# Altium project PCB_Button_PCB.PrjPcb
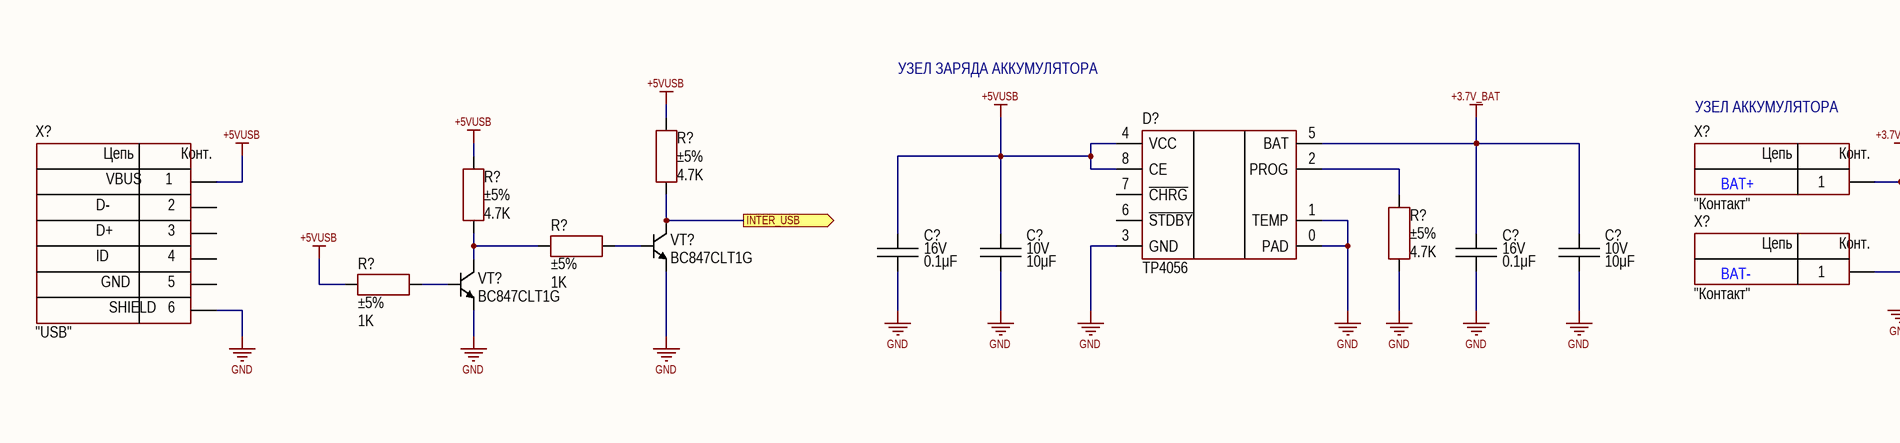
[diagram p0: Sheet2.SchDoc, top left]
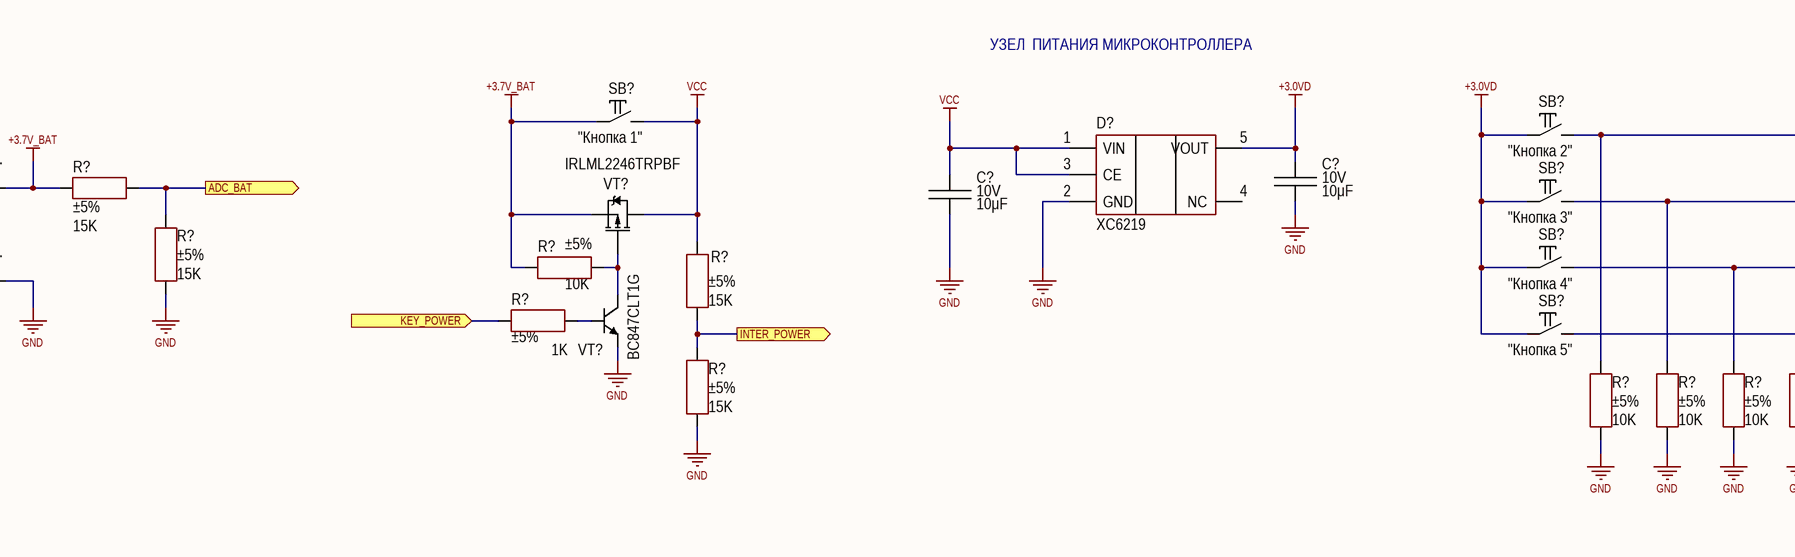
[diagram p1: Sheet2.SchDoc, top middle]
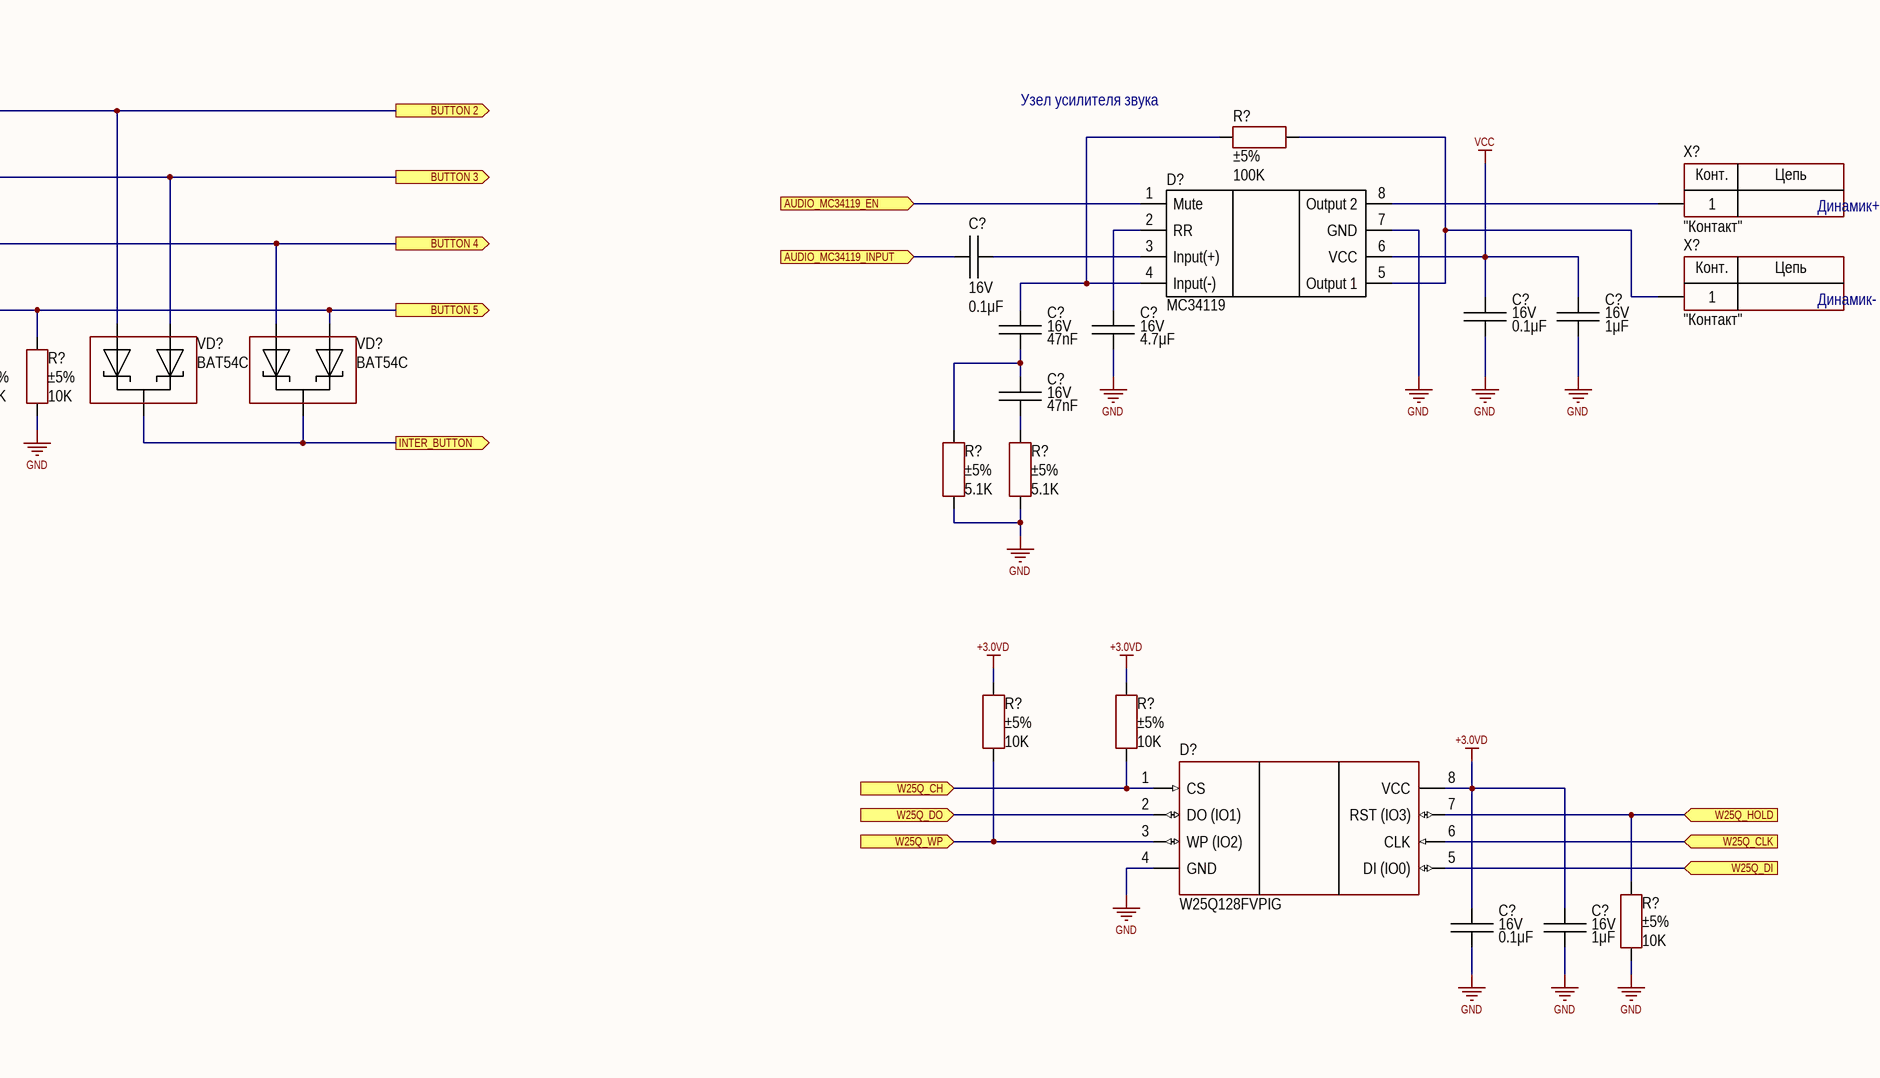
[diagram p2: Sheet2.SchDoc, top right]
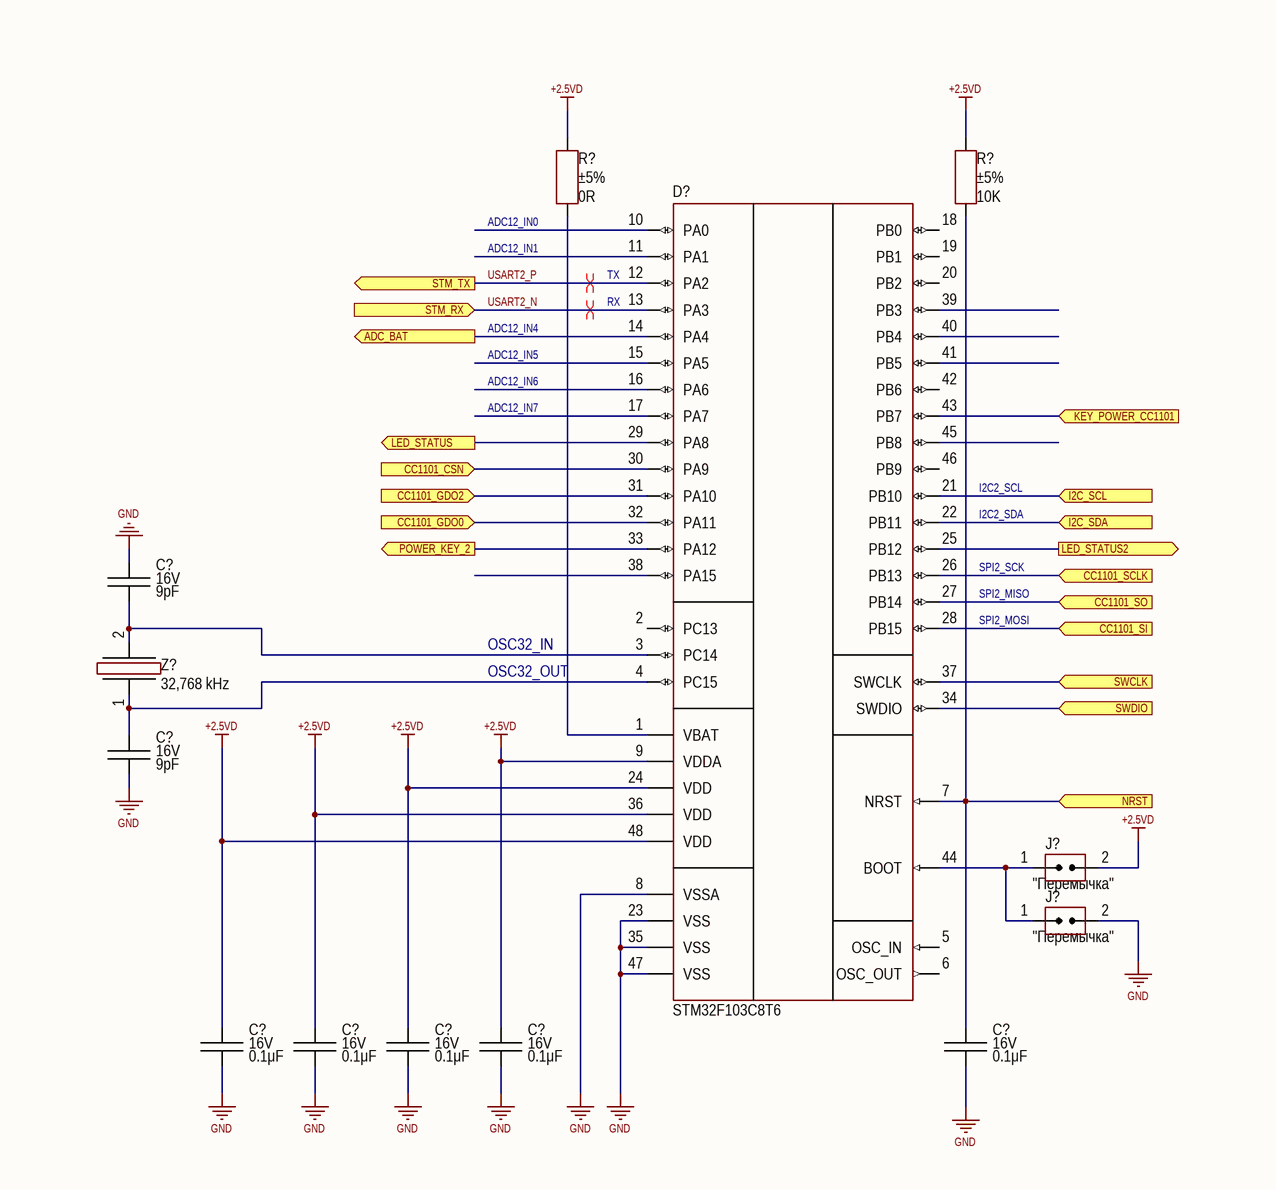
[diagram p3: Sheet2.SchDoc, bottom middle]
1 sheet, 68 parts. Net scope: flat (ports and power ports of the same name join across sheets).
Board file: PCB1.PcbDoc

## Sheet Sheet2.SchDoc
size 1188 x 840 mm; Address1: Address1; Address2: Address2; Address3: Address3; Address4: Address4; DocumentNumber: АБВГ.123456.001 Э3; SheetNumber: 1; Scale: 1:1; DocumentType: Схема электрическая принципиальная; FirstReferrence: АБВГ.123456.001

### Parts
(Parts that share a designator on the sheet are numbered #1, #2 ... from top to bottom, then left to right.)
C?#1  value 10μF  Voltage: 10V  [CAP: 0603]
C?#2  value 10μF  Voltage: 10V  [CAP: 0603]
C?#3  value 0.1μF  Voltage: 16V  [CAP: 0603]
C?#4  value 10μF  Voltage: 10V  [CAP: 0603]
C?#5  value 0.1μF  Voltage: 16V  [CAP: 0603]
C?#6  value 10μF  Voltage: 10V  [CAP: 0603]
C?#7  value 0.1μF  Voltage: 16V  [CAP: 0603]
C?#8  value 4.7μF  Voltage: 16V  [CAP: 0603]
C?#9  value 0.1μF  Voltage: 16V  [CAP: 0603]
C?#10  value 1μF  Voltage: 16V  [CAP: 0603]
C?#11  value 47nF  Voltage: 16V  [CAP: 0603]
C?#12  value 47nF  Voltage: 16V  [CAP: 0603]
C?#13  value 0.1μF  Voltage: 16V  [CAP: 0603]
C?#14  value 1μF  Voltage: 16V  [CAP: 0603]
C?#15  value 9pF  Voltage: 16V  [CAP: 0603]
C?#16  value 9pF  Voltage: 16V  [CAP: 0603]
C?#17  value 0.1μF  Voltage: 16V  [CAP: 0603]
C?#18  value 0.1μF  Voltage: 16V  [CAP: 0603]
C?#19  value 0.1μF  Voltage: 16V  [CAP: 0603]
C?#20  value 0.1μF  Voltage: 16V  [CAP: 0603]
C?#21  value 0.1μF  Voltage: 16V  [CAP: 0603]
D?#1  (no value)  [8-SOIC-PAD]
D?#2  (no value)  [SOT23-5]
D?#3  (no value)  [8-SOIC]
D?#4  (no value)  [8-SOIC]
D?#5  (no value)  [48-LQFP]
J?#1  CommentText: "Перемычка"  [CON: JUMPER x1]
J?#2  CommentText: "Перемычка"  [CON: JUMPER x1]
R?#1  value 4.7K  Tolerance: ±5%  [RES: 0603]
R?#2  value 4.7K  Tolerance: ±5%  [RES: 0603]
R?#3  value 100K  Tolerance: ±5%  [RES: 1206]
R?#4  value 15K  Tolerance: ±5%  [RES: 0603]
R?#5  value 15K  Tolerance: ±5%  [RES: 0603]
R?#6  value 15K  Tolerance: ±5%  [RES: 0603]
R?#7  value 1K  Tolerance: ±5%  [RES: 0603]
R?#8  value 10K  Tolerance: ±5%  [RES: 0603]
R?#9  value 4.7K  Tolerance: ±5%  [RES: 0603]
R?#10  value 1K  Tolerance: ±5%  [RES: 0603]
R?#11  value 1K  Tolerance: ±5%  [RES: 0603]
R?#12  value 15K  Tolerance: ±5%  [RES: 0603]
R?#13  value 10K  Tolerance: ±5%  [RES: 0603]
R?#14  value 10K  Tolerance: ±5%  [RES: 0603]
R?#15  value 10K  Tolerance: ±5%  [RES: 0603]
R?#16  value 10K  Tolerance: ±5%  [RES: 0603]
R?#17  value 5.1K  Tolerance: ±5%  [RES: 0603]
R?#18  value 5.1K  Tolerance: ±5%  [RES: 0603]
R?#19  value 10K  Tolerance: ±5%  [RES: 0603]
R?#20  value 10K  Tolerance: ±5%  [RES: 0603]
R?#21  value 10K  Tolerance: ±5%  [RES: 0603]
R?#22  value 0R  Tolerance: ±5%  [RES: 0603]
R?#23  value 10K  Tolerance: ±5%  [RES: 0603]
SB?#1  CommentText: "Кнопка 1"  [BUT: 5X5 SMD]
SB?#2  CommentText: "Кнопка 2"  [BUT: 5X5 SMD]
SB?#3  CommentText: "Кнопка 3"  [BUT: 5X5 SMD]
SB?#4  CommentText: "Кнопка 4"  [BUT: 5X5 SMD]
SB?#5  CommentText: "Кнопка 5"  [BUT: 5X5 SMD]
VD?#1  PartNumber: BAT54C  [SOT23]
VD?#2  PartNumber: BAT54C  [SOT23]
VT?#1  PartNumber: BC847CLT1G  [SOT23]
VT?#2  PartNumber: IRLML2246TRPBF  [SOT23]
VT?#3  PartNumber: BC847CLT1G  [SOT23]
VT?#4  PartNumber: BC847CLT1G  [SOT23]
X?#1  CommentText: "USB"  [CON: USB micro-A (ZX62-B-5PA)]
X?#2  CommentText: "Контакт"  [CON: Одиночный]
X?#3  CommentText: "Контакт"  [CON: Одиночный]
X?#4  CommentText: "Контакт"  [CON: Одиночный]
X?#5  CommentText: "Контакт"  [CON: Одиночный]
Z?  Frequency: 32,768 kHz  [OSC: SMD 32,768 kHz]

### Ports
ADC_BAT (out), AUDIO_MC34119_EN (in), AUDIO_MC34119_INPUT (in), BUTTON 2 (out), BUTTON 3 (out), BUTTON 4 (out), BUTTON 5 (out), CC1101_CSN (in), CC1101_GDO0 (in), CC1101_GDO2 (in), CC1101_SCLK (in), CC1101_SI (in), CC1101_SO (in), I2C_SCL (in), I2C_SDA (in), INTER_BUTTON (out), INTER_POWER (out), INTER_USB (out), KEY_POWER (in), KEY_POWER_CC1101 (in), LED_STATUS2 (out), LED_STATUS (out), NRST (in), POWER_KEY_2 (out), STM_RX (in), STM_TX (out), SWCLK (in), SWDIO (in), W25Q_CH (in), W25Q_CLK (in), W25Q_DI (in), W25Q_DO (in), W25Q_HOLD (in), W25Q_WP (in)

### Nets
+2.5VD: C?#17.2 C?#18.2 C?#19.2 C?#20.2 D?#5.9(VDDA) D?#5.24(VDD) D?#5.36(VDD) D?#5.48(VDD) J?#1.2(IN) R?#22.2 R?#23.2
+3.0VD: C?#1.2 C?#13.1 C?#14.1 D?#2.5(VOUT) D?#4.8(VCC) R?#19.2 R?#20.2 SB?#2.1 SB?#3.1 SB?#4.1 SB?#5.1
+3.7V_BAT: C?#5.2 C?#6.2 D?#1.5(BAT) R?#4.2 R?#8.1 SB?#1.1 VT?#2.2(S) X?#2.1
+5VUSB: C?#3.2 C?#4.2 D?#1.4(VCC) D?#1.8(CE) R?#1.1 R?#2.1 R?#10.2 X?#1.1
GND: C?#1.1 C?#2.1 C?#3.1 C?#4.1 C?#5.1 C?#6.1 C?#8.1 C?#9.2 C?#10.2 C?#13.2 C?#14.2 C?#15.1 C?#16.2 C?#17.1 C?#18.1 C?#19.1 C?#20.1 C?#21.1 D?#1.0(PAD) D?#1.1(TEMP) D?#1.3(GND) D?#2.2(GND) D?#3.7(GND) D?#4.4(GND) D?#5.8(VSSA) D?#5.23(VSS) D?#5.35(VSS) D?#5.47(VSS) J?#2.2(IN) R?#5.2 R?#9.1 R?#12.2 R?#13.1 R?#14.1 R?#15.1 R?#16.1 R?#17.1 R?#18.1 R?#21.2 VT?#1.2(E) VT?#3.2(E) VT?#4.2(E) X?#1.0 X?#4.1
VCC: C?#2.2 C?#9.1 C?#10.1 D?#2.1(VIN) D?#2.3(CE) D?#3.6(VCC) R?#6.1 SB?#1.2 VT?#2.3(D)
USART2_N: D?#5.13(PA3) ; port STM_RX
USART2_P: D?#5.12(PA2) ; port STM_TX
NetC?#7_1: C?#7.1 D?#3.3(Input(+))
NetC?#7_2: C?#7.2 ; port AUDIO_MC34119_INPUT
NetC?#8_2: C?#8.2 D?#3.2(RR)
NetC?#11_1: C?#11.1 D?#3.4(Input(-)) R?#3.1
NetC?#11_2: C?#11.2 C?#12.1 R?#17.2
NetC?#12_2: C?#12.2 R?#18.2
NetC?#15_2: C?#15.2 D?#5.3(PC14) Z?.2
NetC?#16_1: C?#16.1 D?#5.4(PC15) Z?.1
NetC?#21_2: C?#21.2 D?#5.7(NRST) R?#23.1 ; port NRST
NetD?#1_2: D?#1.2(PROG) R?#9.2
NetD?#3_1: D?#3.1(Mute) ; port AUDIO_MC34119_EN
NetD?#3_5: D?#3.5(Output_1) R?#3.2 X?#5.1
NetD?#3_8: D?#3.8(Output_2) X?#3.1
NetD?#4_1: D?#4.1(CS) R?#20.1 ; port W25Q_CH
NetD?#4_2: D?#4.2(DO_(IO1)) ; port W25Q_DO
NetD?#4_3: D?#4.3(WP_(IO2)) R?#19.1 ; port W25Q_WP
NetD?#4_5: D?#4.5(DI_(IO0)) ; port W25Q_DI
NetD?#4_6: D?#4.6(CLK) ; port W25Q_CLK
NetD?#4_7: D?#4.7(RST_(IO3)) R?#21.1 ; port W25Q_HOLD
NetD?#5_1: D?#5.1(VBAT) R?#22.1
NetD?#5_14: D?#5.14(PA4) R?#4.1 R?#5.1 ; port ADC_BAT
NetD?#5_21: D?#5.21(PB10) ; port I2C_SCL
NetD?#5_22: D?#5.22(PB11) ; port I2C_SDA
NetD?#5_25: D?#5.25(PB12) ; port LED_STATUS2
NetD?#5_26: D?#5.26(PB13) ; port CC1101_SCLK
NetD?#5_27: D?#5.27(PB14) ; port CC1101_SO
NetD?#5_28: D?#5.28(PB15) ; port CC1101_SI
NetD?#5_29: D?#5.29(PA8) ; port LED_STATUS
NetD?#5_30: D?#5.30(PA9) ; port CC1101_CSN
NetD?#5_31: D?#5.31(PA10) ; port CC1101_GDO2
NetD?#5_32: D?#5.32(PA11) ; port CC1101_GDO0
NetD?#5_33: D?#5.33(PA12) ; port POWER_KEY_2
NetD?#5_34: D?#5.34(SWDIO) ; port SWDIO
NetD?#5_37: D?#5.37(SWCLK) ; port SWCLK
NetD?#5_43: D?#5.43(PB7) ; port KEY_POWER_CC1101
NetD?#5_44: D?#5.44(BOOT) J?#1.1(IN) J?#2.1(IN)
NetR?#1_2: R?#1.2 VT?#1.3(C) ; port INTER_USB
NetR?#2_2: R?#2.2 R?#7.2 VT?#3.3(C)
NetR?#6_2: R?#6.2 R?#12.1 ; port INTER_POWER
NetR?#7_1: R?#7.1 VT?#1.1(B)
NetR?#8_2: R?#8.2 VT?#2.1(G) VT?#4.3(C)
NetR?#10_1: R?#10.1 VT?#3.1(B)
NetR?#11_1: R?#11.1 ; port KEY_POWER
NetR?#11_2: R?#11.2 VT?#4.1(B)
NetR?#13_2: R?#13.2 SB?#2.2 VD?#1.2 ; port BUTTON 2
NetR?#14_2: R?#14.2 SB?#3.2 VD?#1.1 ; port BUTTON 3
NetR?#15_2: R?#15.2 SB?#4.2 VD?#2.2 ; port BUTTON 4
NetR?#16_2: R?#16.2 SB?#5.2 VD?#2.1 ; port BUTTON 5
NetVD?#1_3: VD?#1.3 VD?#2.3 ; port INTER_BUTTON

Not connected (* = marked no-connect by the designer): D?#1 6(~{STDBY}) 7(~{CHRG}); D?#2 4(NC); D?#5 2(PC13) 5(OSC_IN) 6(OSC_OUT) 10(PA0) 11(PA1) 15(PA5) 16(PA6) 17(PA7) 18(PB0) 19(PB1) 20(PB2) 38(PA15) 39(PB3) 40(PB4) 41(PB5) 42(PB6) 45(PB8) 46(PB9); X?#1 2 3 4 5

### Layout directives
differential pair: USART2_N, USART2_P

### Notes on the sheet
- УЗЕЛ ЗАРЯДА АККУМУЛЯТОРА
- УЗЕЛ  ПИТАНИЯ МИКРОКОНТРОЛЛЕРА
- УЗЕЛ АККУМУЛЯТОРА
- (near R?#3) Узел усилителя звука
- BAT+
- Динамик+
- BAT-
- Динамик-
- (near R?#22) ADC12_IN0
- (near R?#22) ADC12_IN1
- TX
- RX
- ADC12_IN4
- ADC12_IN5
- ADC12_IN6
- ADC12_IN7
- I2C2_SCL
- I2C2_SDA
- SPI2_MISO
- SPI2_SCK
- OSC32_IN
- SPI2_MOSI
- OSC32_OUT
- Перв. примен.
- Справ. №
- Подп. и дата
- Инв. № дубл.
- Взам. инв. №
- Разраб.
- Изм.
- Лист
- № докум.
- Подп.
- Дата
- Лит.
- Масса
- Масштаб
- Пров.
- Т.контр.
- Листов
- Инв. № подл.
- Утв.
- Н.контр.
- 2.106-A1
- Копировал
- Формат А0
- (in symbol Connector_USB_micro_B) Цепь; Конт.; VBUS; D-; D+; ID; GND; SHIELD; 6

### Library data of the parts
C?#1 C?#2 C?#4 C?#6 = Ceramic_0603: Manufacturer: Yageo; PartNumber: CC0603KRX7R7BB104; ValueManufacturerPartNumber: Ceramic capacitor, 10μF, X7R, ±10%, 10V, 0603, -55...+125°C; TypeCapacitor: Ceramic capacitor; Tolerance: ±10%; TypeDielectric: X7R; BelChip: 28721; Package: 0603; HelpURL: https://www.digikey.com/product-detail/en/yageo/CC0603KRX7R7BB104/311-1088-1-ND/302998; Temperature: -55...+125°C
C?#3 C?#5 C?#17-C?#21 = Ceramic_0603: Manufacturer: Yageo; PartNumber: CC0603KRX7R7BB104; ValueManufacturerPartNumber: Ceramic capacitor, 0.1μF, X7R, ±10%, 16V, 0603, -55...+125°C; TypeCapacitor: Ceramic capacitor; Tolerance: ±10%; TypeDielectric: X7R; BelChip: 47606; Package: 0603; HelpURL: https://www.digikey.com/product-detail/en/yageo/CC0603KRX7R7BB104/311-1088-1-ND/302998; Temperature: -55...+125°C
C?#7 C?#9 C?#13 = Ceramic_0603: Manufacturer: Yageo; PartNumber: CC0603KRX7R7BB104; ValueManufacturerPartNumber: Ceramic capacitor, 0.1μF, X7R, ±10%, 16V, 0603, -55...+125°C; TypeCapacitor: Ceramic capacitor; Tolerance: ±10%; TypeDielectric: X7R; Package: 0603; HelpURL: https://www.digikey.com/product-detail/en/yageo/CC0603KRX7R7BB104/311-1088-1-ND/302998; Temperature: -55...+125°C
C?#8 = Ceramic_0603: Manufacturer: Yageo; PartNumber: CC0603KRX7R7BB104; ValueManufacturerPartNumber: Ceramic capacitor, 4.7μF, X7R, ±10%, 16V, 0603, -55...+125°C; TypeCapacitor: Ceramic capacitor; Tolerance: ±10%; TypeDielectric: X7R; Package: 0603; HelpURL: https://www.digikey.com/product-detail/en/yageo/CC0603KRX7R7BB104/311-1088-1-ND/302998; Temperature: -55...+125°C
C?#10 C?#14 = Ceramic_0603: Manufacturer: Yageo; PartNumber: CC0603KRX7R7BB104; ValueManufacturerPartNumber: Ceramic capacitor, 1μF, X7R, ±10%, 16V, 0603, -55...+125°C; TypeCapacitor: Ceramic capacitor; Tolerance: ±10%; TypeDielectric: X7R; Package: 0603; HelpURL: https://www.digikey.com/product-detail/en/yageo/CC0603KRX7R7BB104/311-1088-1-ND/302998; Temperature: -55...+125°C
C?#11 C?#12 = Ceramic_0603: Manufacturer: Yageo; PartNumber: CC0603KRX7R7BB104; ValueManufacturerPartNumber: Ceramic capacitor, 47nF, X7R, ±10%, 16V, 0603, -55...+125°C; TypeCapacitor: Ceramic capacitor; Tolerance: ±10%; TypeDielectric: X7R; Package: 0603; HelpURL: https://www.digikey.com/product-detail/en/yageo/CC0603KRX7R7BB104/311-1088-1-ND/302998; Temperature: -55...+125°C
C?#15 C?#16 = Ceramic_0603: Manufacturer: Yageo; PartNumber: CC0603KRX7R7BB104; ValueManufacturerPartNumber: Ceramic capacitor, 9pF, X7R, ±10%, 16V, 0603, -55...+125°C; TypeCapacitor: Ceramic capacitor; Tolerance: ±10%; TypeDielectric: X7R; Package: 0603; HelpURL: https://www.digikey.com/product-detail/en/yageo/CC0603KRX7R7BB104/311-1088-1-ND/302998; Temperature: -55...+125°C
D?#1 = TP4056: Li-lon Battery Charger; CurrentOutput: 1A; HelpURL: https://dlnmh9ip6v2uc.cloudfront.net/datasheets/Prototyping/TP4056.pdf; Package: SOP-8; ComponentType: 1A Standalone Linear Li-lon Battery Charger with Thermal; ValueManufacturerPartNumber: =ComponentType+', '+VoltageInput+', '+Frequency+', '+VoltageOutput+', '+CurrentOutput+', '+Temperature+', '+Package; Temperature: -40...+85°C; PartNumber: TP4056
D?#2 = XC6219: Positive voltage regulators; ValueManufacturerPartNumber: Linear voltage regulator, input 3.9...7V, 12mV, output 3.3V, 300mA, -40...+85°C, SOT-23-5; VoltageInput: input 3.9...7V; MaxDropout: 12mV; CurrentOutput: 300mA; VoltageOutput: output 3.3V; HelpURL: https://lcsc.com/product-detail/Linear-Voltage-Regulators-LDO_UMW-Youtai-Semiconductor-Co-Ltd-XC6219B332MR_C347386.html; Package: SOT-23-5; ComponentType: Linear voltage regulator; Temperature: -40...+85°C; PartNumber: XC6219
D?#3 = MC34119: Audio amplifier; Manufacturer: Texas Instruments; ValueManufacturerPartNumber: IC audio amplifier, Class D, 2.65W, 2...16V, -40...+85°C, 8-SOIC; Supply: 2...16V; OutputType: Class D; OutputPower: 2.65W; HelpURL: UNISONIC TECHNOLOGIES CO., LTD; Package: 8-SOIC; ComponentType: IC audio amplifier; Temperature: -40...+85°C; PartNumber: MC34119
D?#4 = W25Q128FVPIG: FLASH; Manufacturer: Winbond Electronics; ValueManufacturerPartNumber: IC memory, FLASH, 128Mb (16M x 8), 104 MHz, SPI/QuadSPI, 2.7...3.6V, -40...+85°C, 8-WSON; Supply: 2.7...3.6V; Speed: 104 MHz; InterfaceData: SPI/QuadSPI; MemorySize: 128Mb (16M x 8); HelpURL: https://www.digikey.com/product-detail/en/winbond-electronics/W25Q128FVPIG/W25Q128FVPIG-ND/4037386; Package: 8-WSON; ComponentType: IC memory; Temperature: -40...+85°C; MemoryType: FLASH; PartNumber: W25Q128FVPIG
D?#5 = STM32F103C8T6: Cortex-M3; Manufacturer: STMicroelectronics; ValueManufacturerPartNumber: IC microcontroller, 32-Bit, Cortex-M3, 72MHz, 64KB, 20KB, 2...3.6V, -40...+85°C, 48-LQFP; Supply: 2...3.6V; Speed: 72MHz; CoreSize: 32-Bit; MemoryROM: 64KB; MemoryRAM: 20KB; HelpURL: https://www.digikey.com/product-detail/en/stmicroelectronics/STM32F103C8T6TR/497-17666-1-ND/7804402; Package: 48-LQFP; ComponentType: IC microcontroller; Temperature: -40...+85°C; CoreProcessor: Cortex-M3; PartNumber: STM32F103C8T6
J?#1 J?#2 = Jumper_single
R?#1 R?#2 R?#9 = Resistor_0603: Manufacturer: Yageo; PartNumber: RC0603JR-07100RL; ValueManufacturerPartNumber: Resistor film, 4.7K, ±5%, 0603, 0.1W, -55...+125°C; TypeResistor: Resistor film; Power: 0.1W; Package: 0603; HelpURL: https://www.digikey.com/product-detail/en/yageo/RC0603JR-07100RL/311-100GRCT-ND/729644; Temperature: -55...+125°C
R?#3 = Resistor_1206: Manufacturer: Yageo; PartNumber: RC1206JR-07100RL; ValueManufacturerPartNumber: Resistor film, 100K, ±5%, 1206, 0.25W, -55...+125°C; TypeResistor: Resistor film; Power: 0.25W; Package: 1206; HelpURL: https://www.digikey.com/product-detail/en/yageo/RC1206JR-07100RL/311-100ERCT-ND/732153; Temperature: -55...+125°C
R?#4-R?#6 R?#12 = Resistor_0603: Manufacturer: Yageo; PartNumber: RC0603JR-07100RL; ValueManufacturerPartNumber: Resistor film, 15K, ±5%, 0603, 0.1W, -55...+125°C; TypeResistor: Resistor film; Power: 0.1W; Package: 0603; HelpURL: https://www.digikey.com/product-detail/en/yageo/RC0603JR-07100RL/311-100GRCT-ND/729644; Temperature: -55...+125°C
R?#7 R?#10 R?#11 = Resistor_0603: Manufacturer: Yageo; PartNumber: RC0603JR-07100RL; ValueManufacturerPartNumber: Resistor film, 1K, ±5%, 0603, 0.1W, -55...+125°C; TypeResistor: Resistor film; Power: 0.1W; Package: 0603; HelpURL: https://www.digikey.com/product-detail/en/yageo/RC0603JR-07100RL/311-100GRCT-ND/729644; Temperature: -55...+125°C
R?#8 R?#13-R?#16 R?#19-R?#21 R?#23 = Resistor_0603: Manufacturer: Yageo; PartNumber: RC0603JR-07100RL; ValueManufacturerPartNumber: Resistor film, 10K, ±5%, 0603, 0.1W, -55...+125°C; TypeResistor: Resistor film; Power: 0.1W; Package: 0603; HelpURL: https://www.digikey.com/product-detail/en/yageo/RC0603JR-07100RL/311-100GRCT-ND/729644; Temperature: -55...+125°C
R?#17 R?#18 = Resistor_0603: Manufacturer: Yageo; PartNumber: RC0603JR-07100RL; ValueManufacturerPartNumber: Resistor film, 5.1K, ±5%, 0603, 0.1W, -55...+125°C; TypeResistor: Resistor film; Power: 0.1W; Package: 0603; HelpURL: https://www.digikey.com/product-detail/en/yageo/RC0603JR-07100RL/311-100GRCT-ND/729644; Temperature: -55...+125°C
R?#22 = Resistor_0603: Manufacturer: Yageo; PartNumber: RC0603JR-07100RL; ValueManufacturerPartNumber: Resistor film, 0R, ±5%, 0603, 0.1W, -55...+125°C; TypeResistor: Resistor film; Power: 0.1W; Package: 0603; HelpURL: https://www.digikey.com/product-detail/en/yageo/RC0603JR-07100RL/311-100GRCT-ND/729644; Temperature: -55...+125°C
SB?#1-SB?#5 = Button_tactile: Manufacturer: TE Connectivity; ValueManufacturerPartNumber: Tactile button, 6x6mm; PartNumber: FSM2JSMAATR; TypeButton: Tactile button; HelpURL: https://www.digikey.com/product-detail/en/te-connectivity-alcoswitch-switches/FSM2JSMAATR/450-1792-1-ND/3503931; Package: 6x6mm
VD?#1 VD?#2 = BAT54С: 200mWatt, 30Volt Schottky Barrier Diode; Manufacturer: Micro Commercial Components Corp. (MCC); TypeDiode: Schottky diode; Voltage: 30V; Current: 200mA; VoltageDrop: 0.32V; RecoveryTime: 10pF; Package: SOT-23; HelpURL: https://www.chipdip.by/product/bat54c-tp-reel-3000; ValueManufacturerPartNumber: =TypeDiode+', '+Voltage+', '+Current+', '+VoltageDrop+', '+RecoveryTime+', '+Package+', '+Temperature
VT?#1 VT?#3 VT?#4 = BJT_NPN_132: Manufacturer: ON Semiconductor; ValueManufacturerPartNumber: NPN transistor, 45V, 100mA, 100MHz, 300mW, 0.6V, 420, SOT-23, -55...+125°C; TypeTransistor: NPN transistor; VoltageCE: 45V; CurrentCE: 100mA; VoltageSaturation: 0.6V; Frequency: 100MHz; CurrentGain: 420; MaxPower: 300mW; Package: SOT-23; HelpURL: https://www.digikey.com/product-detail/en/on-semiconductor/BC847CLT1G/BC847CLT1GOSCT-ND/917836; Temperature: -55...+125°C
VT?#2 = MOSFET_P_132: Manufacturer: Infineon Technologies; ValueManufacturerPartNumber: MOSFET P-channel transistor, 20V, 2.6A, 2.9nC, 2.5W, 135mOhm, 220pF, SOT-23, -55...+150°C; TypeTransistor: MOSFET P-channel transistor; VoltageDS: 20V; CurrentDS: 2.6A; RDS: 135mOhm; GateCharge: 2.9nC; InputCapacitor: 220pF; MaxPower: 2.5W; Package: SOT-23; HelpURL: https://www.digikey.com/product-detail/en/infineon-technologies/IRLML2246TRPBF/IRLML2246TRPBFCT-ND/2639576; Temperature: -55...+150°C
X?#1 = Connector_USB_micro_B: Manufacturer: Hirose Electric; ValueManufacturerPartNumber: USB micro B; PartNumber: ZX62-B-5PA; HelpURL: https://www.digikey.com/product-detail/en/hirose-electric-co-ltd/ZX62-B-5PA/H11579CT-ND/1851090; TypeConnector: USB micro B
X?#2-X?#5 = Одиночный контакт: TypeConnector: Connector; Multichannel: 1pin; ValueManufacturerPartNumber: =TypeConnector+', '+Multichannel+', '+Pitch+', '+VoltageMax+', '+CurrentMax
Z? = Crystal_KX-38T: Quartz Crystal 32,768 kHz; Manufacturer: geyer-electronic; PartNumber: FC-135 32.7680KA-A5; ValueManufacturerPartNumber: Crystal, 32,768 kHz, 12.5pF, ±20ppm, case 3215, -40...+85°C; LoadCapacitance: 12.5pF; Tolerance: ±20ppm; Package: case 3215; HelpURL: https://belchip.by/sitedocs/18330.pdf; Temperature: -40...+85°C; TypeOscilator: Crystal